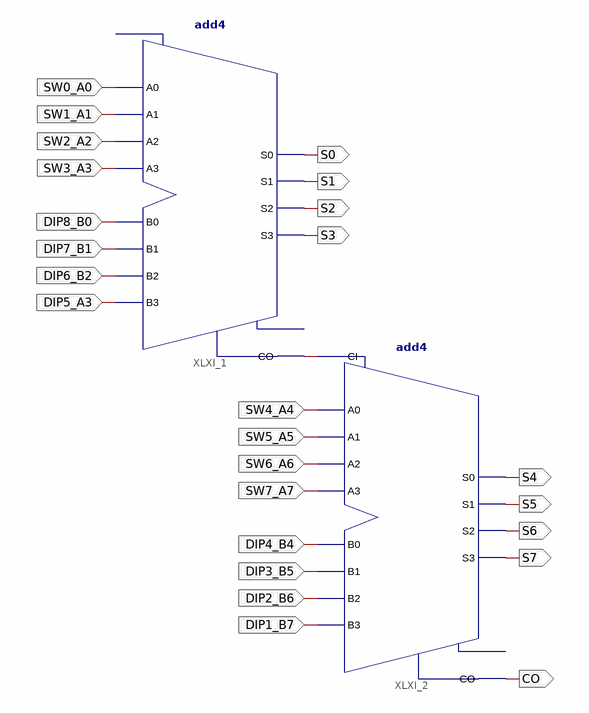
[diagram p0: schematic sheet 1]
// Xilinx ISE schematic ADD8bits.sch (spartan6) as structural Verilog: 2 symbols, 25 ports
module ADD8bits (
  input  SW0_A0,
  input  SW1_A1,
  input  SW2_A2,
  input  SW3_A3,
  input  DIP8_B0,
  input  DIP7_B1,
  input  DIP6_B2,
  input  DIP5_A3,
  input  SW4_A4,
  input  SW5_A5,
  input  SW6_A6,
  input  SW7_A7,
  input  DIP4_B4,
  input  DIP3_B5,
  input  DIP2_B6,
  input  DIP1_B7,
  output S4,
  output S5,
  output S6,
  output S7,
  output S3,
  output S2,
  output S0,
  output S1,
  output CO
);

  wire XLXN_1;

  add4 XLXI_1 (
    .A0(SW0_A0), .A1(SW1_A1), .A2(SW2_A2), .A3(SW3_A3), .B0(DIP8_B0), .B1(DIP7_B1), .B2(DIP6_B2),
    .B3(DIP5_A3), .CO(XLXN_1), .S0(S0), .S1(S1), .S2(S2), .S3(S3));  // open: CI, OFL
  add4 XLXI_2 (
    .A0(SW4_A4), .A1(SW5_A5), .A2(SW6_A6), .A3(SW7_A7), .B0(DIP4_B4), .B1(DIP3_B5), .B2(DIP2_B6),
    .B3(DIP1_B7), .CI(XLXN_1), .CO(CO), .S0(S4), .S1(S5), .S2(S6), .S3(S7));  // open: OFL
endmodule
